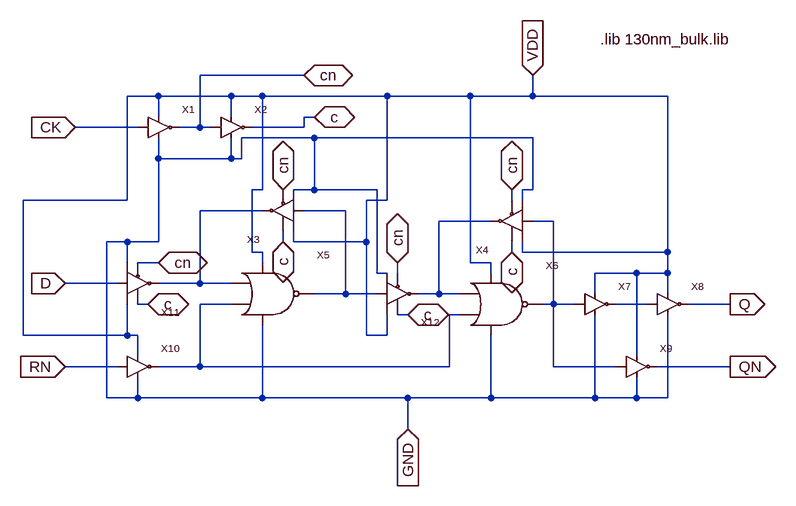
[diagram p0: schematic FFD_RS_fix.asc]
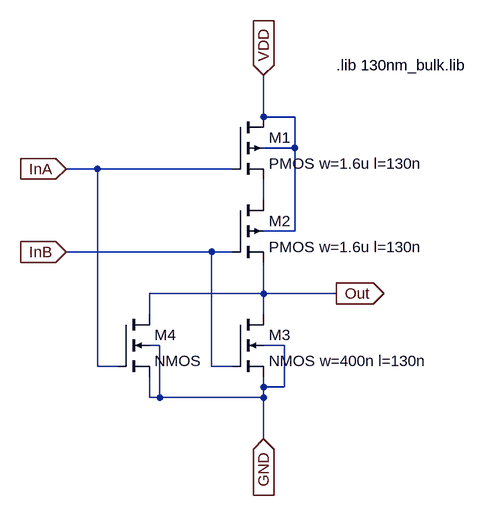
[diagram p1: sub-circuit nor.asc]
FFD_RS_fix.asc, the LTspice schematic file:
Version 4
SHEET 1 880 680
WIRE 128 -64 -32 -64
WIRE -96 -32 -144 -32
WIRE 16 -32 -96 -32
WIRE 64 -32 16 -32
WIRE 256 -32 64 -32
WIRE 384 -32 256 -32
WIRE 480 -32 480 -64
WIRE 480 -32 384 -32
WIRE 688 -32 480 -32
WIRE -96 0 -96 -32
WIRE 16 0 16 -32
WIRE 144 0 128 0
WIRE -128 16 -224 16
WIRE -32 16 -32 -64
WIRE -32 16 -64 16
WIRE -16 16 -32 16
WIRE 128 16 128 0
WIRE 128 16 48 16
WIRE 144 32 32 32
WIRE 480 32 144 32
WIRE -96 64 -96 32
WIRE 16 64 16 32
WIRE 16 64 -96 64
WIRE 32 64 32 32
WIRE 32 64 16 64
WIRE 64 112 64 -32
WIRE 64 112 48 112
WIRE 144 112 144 32
WIRE 144 112 112 112
WIRE 240 112 144 112
WIRE 480 112 480 32
WIRE 480 112 464 112
WIRE -144 128 -144 -32
WIRE -144 128 -304 128
WIRE 256 128 256 -32
WIRE 256 128 224 128
WIRE 448 128 448 112
WIRE 464 128 464 112
WIRE 64 144 -32 144
WIRE 192 144 128 144
WIRE 416 160 336 160
WIRE 512 160 480 160
WIRE -144 192 -176 192
WIRE -96 192 -96 64
WIRE -96 192 -144 192
WIRE 96 192 96 176
WIRE 112 192 112 176
WIRE 224 192 224 128
WIRE 224 192 112 192
WIRE 48 208 48 112
WIRE 64 208 48 208
WIRE 448 208 448 192
WIRE 464 208 464 192
WIRE 688 208 688 -32
WIRE 688 208 464 208
WIRE -144 224 -144 192
WIRE -96 224 -128 224
WIRE 64 224 64 208
WIRE 384 224 384 -32
WIRE 416 224 384 224
WIRE 240 240 240 112
WIRE 256 240 240 240
WIRE 272 240 272 224
WIRE 416 240 416 224
WIRE 640 240 576 240
WIRE 688 240 688 208
WIRE 688 240 640 240
WIRE -160 256 -240 256
WIRE -32 256 -32 144
WIRE -32 256 -96 256
WIRE 16 256 -32 256
WIRE 192 272 192 144
WIRE 192 272 144 272
WIRE 240 272 192 272
WIRE 336 272 336 160
WIRE 336 272 304 272
WIRE 368 272 336 272
WIRE 576 272 576 240
WIRE 688 272 688 240
WIRE -112 288 -128 288
WIRE 16 288 -32 288
WIRE 512 288 512 160
WIRE 512 288 496 288
WIRE 544 288 512 288
WIRE 656 288 608 288
WIRE 784 288 720 288
WIRE 288 304 272 304
WIRE 368 304 352 304
WIRE -304 336 -304 128
WIRE -144 336 -144 288
WIRE -144 336 -304 336
WIRE -128 336 -144 336
WIRE 224 336 224 192
WIRE 256 336 256 304
WIRE 256 336 224 336
WIRE -128 368 -128 336
WIRE 640 368 640 240
WIRE -160 384 -240 384
WIRE -32 384 -32 288
WIRE -32 384 -96 384
WIRE 352 384 352 304
WIRE 352 384 -32 384
WIRE 512 384 512 288
WIRE 608 384 512 384
WIRE 784 384 672 384
WIRE -176 432 -176 192
WIRE -128 432 -128 400
WIRE -128 432 -176 432
WIRE 64 432 64 320
WIRE 64 432 -128 432
WIRE 288 432 64 432
WIRE 416 432 416 336
WIRE 416 432 288 432
WIRE 576 432 576 304
WIRE 576 432 416 432
WIRE 640 432 640 400
WIRE 640 432 576 432
WIRE 688 432 688 304
WIRE 688 432 640 432
WIRE 288 480 288 432
FLAG -224 16 CK
IOPIN -224 16 In
FLAG 128 -64 cn
IOPIN 128 -64 BiDir
FLAG -240 384 RN
IOPIN -240 384 In
FLAG -240 256 D
IOPIN -240 256 In
FLAG 784 288 Q
IOPIN 784 288 Out
FLAG 784 384 QN
IOPIN 784 384 Out
FLAG 96 112 cn
IOPIN 96 112 BiDir
FLAG 272 224 cn
IOPIN 272 224 BiDir
FLAG 96 192 c
IOPIN 96 192 BiDir
FLAG 288 304 c
IOPIN 288 304 BiDir
FLAG 480 -64 VDD
IOPIN 480 -64 In
FLAG 288 480 GND
IOPIN 288 480 In
FLAG 144 0 c
IOPIN 144 0 BiDir
FLAG -96 224 cn
IOPIN -96 224 BiDir
FLAG -112 288 c
IOPIN -112 288 BiDir
FLAG 448 112 cn
IOPIN 448 112 BiDir
FLAG 448 208 c
IOPIN 448 208 BiDir
SYMBOL Inverter -64 32 R0
SYMATTR InstName X1
SYMBOL Inverter 48 32 R0
SYMATTR InstName X2
SYMBOL Tristate_Inv 32 112 R180
SYMATTR InstName X3
SYMBOL Tristate_Inv 384 128 R180
SYMATTR InstName X4
SYMBOL NOR 48 272 R0
SYMATTR InstName X5
SYMBOL NOR 400 288 R0
SYMATTR InstName X6
SYMBOL Inverter 608 304 R0
SYMATTR InstName X7
SYMBOL Inverter 720 304 R0
SYMATTR InstName X8
SYMBOL Inverter 672 400 R0
SYMATTR InstName X9
SYMBOL Inverter -96 400 R0
SYMATTR InstName X10
SYMBOL Tristate_Inv -64 224 M180
SYMATTR InstName X11
SYMBOL Tristate_Inv 336 240 M180
SYMATTR InstName X12
TEXT 584 -120 Left 2 !.lib 130nm_bulk.lib

nor.asc, the sub-circuit schematic file:
Version 4
SHEET 1 880 680
WIRE 240 16 240 -48
WIRE 288 16 240 16
WIRE 288 64 288 16
WIRE 288 64 240 64
WIRE -16 96 -64 96
WIRE 192 96 -16 96
WIRE 240 144 240 112
WIRE 288 192 288 64
WIRE 288 192 240 192
WIRE 160 224 -64 224
WIRE 192 224 160 224
WIRE 240 288 240 240
WIRE 240 288 64 288
WIRE 352 288 240 288
WIRE 64 320 64 288
WIRE 240 320 240 288
WIRE 80 368 64 368
WIRE 272 368 240 368
WIRE -16 400 -16 96
WIRE 16 400 -16 400
WIRE 160 400 160 224
WIRE 192 400 160 400
WIRE 240 432 240 416
WIRE 272 432 272 368
WIRE 272 432 240 432
WIRE 64 448 64 416
WIRE 80 448 80 368
WIRE 80 448 64 448
WIRE 240 448 240 432
WIRE 240 448 80 448
WIRE 240 512 240 448
FLAG -64 96 InA
IOPIN -64 96 In
FLAG -64 224 InB
IOPIN -64 224 In
FLAG 240 -48 VDD
IOPIN 240 -48 In
FLAG 240 512 GND
IOPIN 240 512 In
FLAG 352 288 Out
IOPIN 352 288 Out
SYMBOL pmos4 192 16 R0
SYMATTR InstName M1
SYMATTR Value2 l=130n w=1.6u
SYMATTR Value PMOS w=1.6u l=130n
SYMBOL pmos4 192 144 R0
SYMATTR InstName M2
SYMATTR Value2 l=130n w=1.6u
SYMATTR Value PMOS w=1.6u l=130n
SYMBOL nmos4 192 320 R0
SYMATTR InstName M3
SYMATTR Value2 l=130n w=400n
SYMATTR Value NMOS w=400n l=130n
SYMBOL nmos4 16 320 R0
SYMATTR InstName M4
SYMATTR Value2 l=130n w=400n
TEXT 352 -64 Left 2 !.lib 130nm_bulk.lib

The netlist it stands for:
* FFD_RS_fix.asc
XX1 CK VDD GND cn Inverter  ; pins In VDD GND Out
XX2 cn VDD GND c Inverter  ; pins In VDD GND Out
XX3 N002 VDD GND c cn N001 Tristate_Inv  ; pins In VDD GND EN NEN Out
XX4 N004 VDD GND c cn N003 Tristate_Inv  ; pins In VDD GND EN NEN Out
XX5 N001 N005 VDD GND N002 nor
XX6 N003 N005 VDD GND N004 nor
XX7 N004 VDD GND N006 Inverter  ; pins In VDD GND Out
XX8 N006 VDD GND Q Inverter  ; pins In VDD GND Out
XX9 N004 VDD GND QN Inverter  ; pins In VDD GND Out
XX10 RN VDD GND N005 Inverter  ; pins In VDD GND Out
XX11 D VDD GND c cn N001 Tristate_Inv  ; pins In VDD GND EN NEN Out
XX12 N002 VDD GND c cn N003 Tristate_Inv  ; pins In VDD GND EN NEN Out

* block symbol definitions
.subckt nor InA InB VDD GND Out
M1 VDD InA N001 VDD PMOS w=1.6u l=130n l=130n w=1.6u
M2 N001 InB Out VDD PMOS w=1.6u l=130n l=130n w=1.6u
M3 Out InB GND GND NMOS w=400n l=130n l=130n w=400n
M4 Out InA GND GND NMOS l=130n w=400n
.lib 130nm_bulk.lib
.ends nor

.model NMOS NMOS
.model PMOS PMOS
.lib standard.mos
.lib 130nm_bulk.lib
.backanno
.end